# Altium schematic sheet Sheet1.SchDoc
size A; SheetNumber: 6; SheetTotal: 6
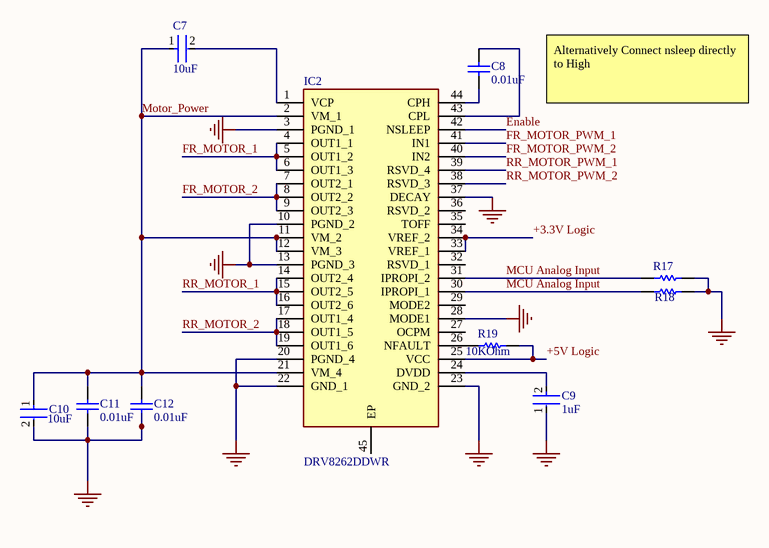
[diagram p0: Sheet1.SchDoc]

## Parts
C7  Capacitance: 10uF  [FP-GRM32-MFG]  (hidden comment: GRM32ER71H106KA12L)
C8  CAPACITANCE: 0.01uF  [CAPC1608X92X38NL15T08]  (hidden comment: VJ0603Y103MXXAC)
C9  Capacitance: 1uF  [FP-GRM188-0_1-MFG]  (hidden comment: GRM188R60J105KA01D)
C10  Capacitance: 10uF  [FP-GRM32-MFG]  (hidden comment: GRM32ER71H106KA12L)
C11  Capacitance: 0.01uF  [CAPC1608X92X38NL15T08]  (hidden comment: VJ0603Y103MXXAC)
C12  CAPACITANCE: 0.01uF  [CAPC1608X92X38NL15T08]  (hidden comment: VJ0603Y103MXXAC)
IC2  DRV8262DDWR  [SOP64P810X120-45N]
R17  ERJ-3EKF2611V  [RESC1608X55X30NL15T15]  (value not drawn)
R18  ERJ-3EKF2611V  [RESC1608X55X30NL15T15]  (value not drawn)
R19  Resistance: 10KOhm  [RESC1609X55X30LL15T15]  (hidden comment: ERJ3EKF1002V)

## Nets
GND: C9.1 C10.2 C11.1 C12.1 IC2.3(PGND_1) IC2.10(PGND_2) IC2.13(PGND_3) IC2.20(PGND_4) IC2.22(GND_1) IC2.23(GND_2) IC2.28(MODE1) IC2.37(DECAY) R17.2 R18.2
+3.3V Logic: IC2.33(VREF_1) IC2.34(VREF_2)
+5V Logic: IC2.25(VCC) R19.2
Enable: IC2.42(NSLEEP)
FR_MOTOR_1: IC2.4(OUT1_1) IC2.5(OUT1_2) IC2.6(OUT1_3)
FR_MOTOR_2: IC2.7(OUT2_1) IC2.8(OUT2_2) IC2.9(OUT2_3)
FR_MOTOR_PWM_1: IC2.41(IN1)
FR_MOTOR_PWM_2: IC2.40(IN2)
MCU Analog Input: IC2.30(IPROPI_1) IC2.31(IPROPI_2) R17.1 R18.1
Motor_Power: C7.1 C10.1 C11.2 C12.2 IC2.2(VM_1) IC2.11(VM_2) IC2.12(VM_3) IC2.21(VM_4)
RR_MOTOR_1: IC2.14(OUT2_4) IC2.15(OUT2_5) IC2.16(OUT2_6)
RR_MOTOR_2: IC2.17(OUT1_4) IC2.18(OUT1_5) IC2.19(OUT1_6)
RR_MOTOR_PWM_1: IC2.39(RSVD_4)
RR_MOTOR_PWM_2: IC2.38(RSVD_3)
NetC7_2: C7.2 IC2.1(VCP)
NetC8_1: C8.1 IC2.44(CPH)
NetC8_2: C8.2 IC2.43(CPL)
NetC9_2: C9.2 IC2.24(DVDD)
NetIC2_26: IC2.26(NFAULT) R19.1

Not connected (* = marked no-connect by the designer): IC2 27(OCPM) 29(MODE2) 32(RSVD_1) 35(TOFF) 36(RSVD_2) 45(EP)

## Notes on the sheet
- Alternatively Connect nsleep directly to High

## Library data of the parts
C7 C10 = CMP-2000-05261-2: CAP CER 10UF 50V X7R 1210; Manufacturer: Murata; Tolerance: 10%; Material: Ceramic; Temperature Coefficient: 15%; Voltage Rating: 50V; Temperature Characteristic: X7R; Value: 10uF; ComponentLink2Description: Datasheet; Device Class L1: Passive Components; Lead Free: Yes; Temperature Range High: +125°C; Category: Cap; Manufacturer Part Number: GRM32ER71H106KA12L; ComponentLink2URL: https://search.murata.co.jp/Ceramy/image/img/A01X/G101/ENG/GRM32ER71H106KA12-01.pdf; Device Class L2: Capacitors; Package: GRM32; Mouser Description: 1210 10 uF 50 V ±10% Tolerance X7R SMT Multilayer Ceramic Capacitor; Octopart: https://octopart.com/grm32er71h106ka12l-murata-10470987; Digikey Description: CAP CER 10UF 50V X7R 1210; Height: 2.7mm; Temperature: -55°C to +125°C; Temperature Range Low: -55°C; RoHS: TRUE; Device Class L3: Ceramic Capacitors; Automotive: No
C8 C11 C12 = CMP-2006-01265-1: Manufacturer: Vitramon; Part Number: VJ0603Y103MXXAC
C9 = CMP-2006-02790-2: CAP CER 1UF 6.3V X5R 0603; Insulation Resistance: 500MR; Tolerance: 10%; Dielectric Material: Ceramic; Thickness: 0.035inch; Depth: 0.8mm; Min Operating Temperature: -55°C; Mount: Surface Mount; Voltage Rating (DC): 6.3V; Case/Package: 0603; Voltage Rating: 6.3V; Voltage: 6.3V; Max Operating Temperature: 85°C; Case Code (Imperial): 0603; Dielectric: X5R; Packaging: Tape and Reel; Height: 0.8mm; Case Code (Metric): 1608; Radiation Hardening: No; REACH SVHC: No SVHC; Width: 0.031inch; Package Quantity: 1; Lead Free: Lead Free; Length: 1.6mm; Termination: SMD/SMT
IC2 = DRV8262DDWR: Integrated Circuit; Manufacturer_Name: Texas Instruments; Datasheet Link: https://www.arrow.com/en/products/drv8262ddwr/texas-instruments?region=nac; Height: 1.2mm; Manufacturer_Part_Number: DRV8262DDWR; Mouser Part Number: 595-DRV8262DDWR; Mouser Price/Stock: https://www.mouser.co.uk/ProductDetail/Texas-Instruments/DRV8262DDWR?qs=1Kr7Jg1SGW8MeFim1i6uiA%3D%3D; Arrow Part Number: DRV8262DDWR; Arrow Price/Stock: https://www.arrow.com/en/products/drv8262ddwr/texas-instruments?region=nac
R17 R18 = CMP-2000-00380-1: Manufacturer: Panasonic; Part Number: ERJ-3EKF2611V
R19 = CMP-1012-00623-3: Chip Resistor, 10 KOhm, +/- 1%, 0.1 W, -55 to 155 degC, 0603 (1608 Metric), RoHS, Tape and Reel; Manufacturer: Panasonic; Voltage Rating: 75V; Case\/Package: 0603; Power Rating: 100mW; Temperature Coefficient: 100ppm\/degreesC; Number of Pins: 2; Package Reference: 603; Depth: 0.8mm; Mount: SurfaceMount; Package Description: 2-Pin Surface Mount Device, Body 1.6 x 0.85 mm; Datasheet Version: 02/2017; Length: 1.6mm; Lead Free: LeadFree; Height: 0.45mm; Number of Terminations: 2; Max Power Dissipation: 100mW; Min Operating Temperature: -55degC; Datasheet URL: https://industrial.panasonic.com/cdbs/www-data/pdf/RDA0000/AOA0000C304.pdf; Termination: SMD/SMT; Case Code (Metric): 1608; Case Code (Imperial): 0603; Tolerance: 1%; Max Operating Temperature: 155degC; RoHSCompliant: true; Voltage Rating (DC): 75V; Radiation Hardening: No; Packaging: TapeandReel; Composition: ThickFilm; Mounting Technology: SurfaceMount; Manufacturer URL: http://www.panasonic.com/; Width: 0.031inch; REACH SVHC: NoSVHC; Contact Plating: Tin; Military Standard: Not; Package Quantity: 1